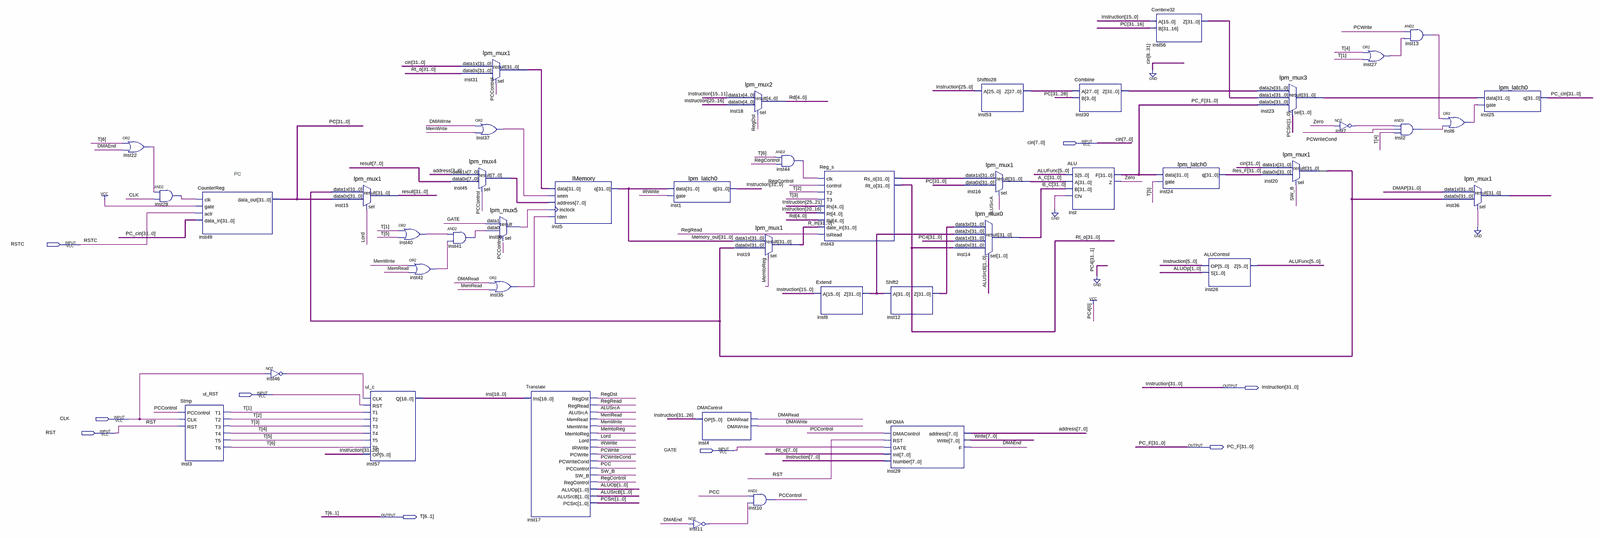
[diagram p0: schematic sheet, whole]
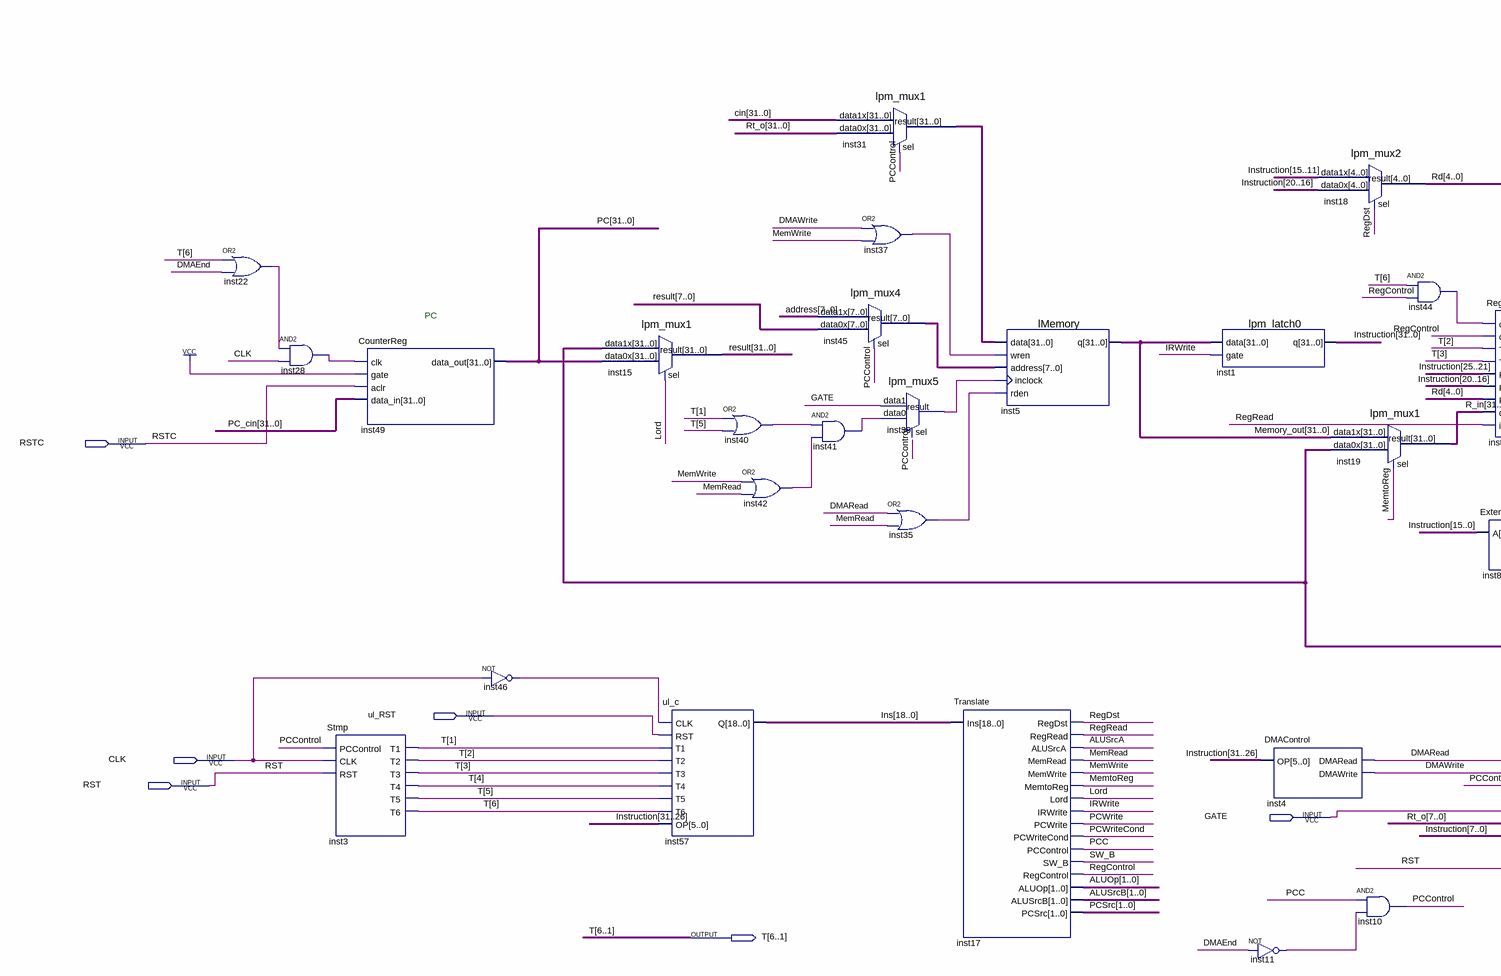
[diagram p1: schematic sheet, left part]
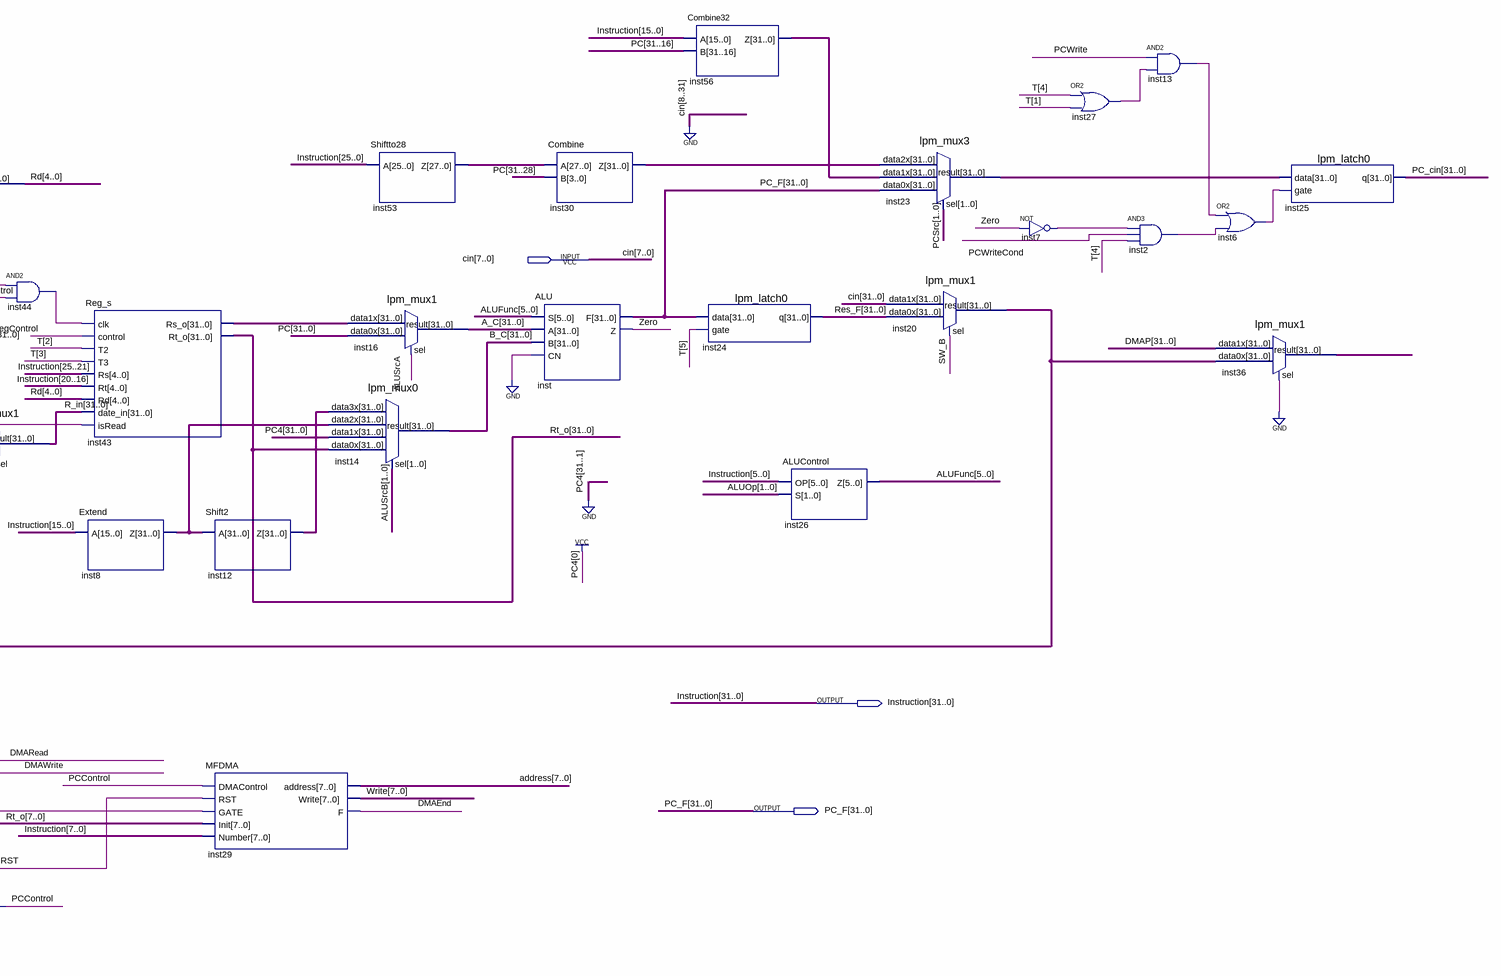
[diagram p2: schematic sheet, right part]
// Quartus schematic MIPS.bdf as structural Verilog: 45 symbols, 9 pins
module MIPS (
  input  [7:0] cin,
  input  RSTC,
  input  ul_RST,
  input  CLK,
  input  RST,
  input  GATE,
  output [31:0] Instruction,
  output [31:0] PC_F,
  output [6:1] T
);

  wire ALUSrcA, DMAEnd, DMARead, DMAWrite, inst2_out, inst6_out, inst7_out, inst11_out, inst13_out,
       inst22_out, inst27_out, inst28_out, inst35_out, inst37_out, inst39_result, inst40_out, inst41_out,
       inst42_out, inst44_out, inst46_out, IRWrite, Lord, MemRead, MemtoReg, MemWrite, PCC, PCControl,
       PCWrite, PCWriteCond, RegControl, RegDst, RegRead, SW_B, Zero;
  wire [1:0] ALUOp, ALUSrcB, PCSrc;
  wire [4:0] Rd;
  wire [5:0] ALUFunc;
  wire [7:0] address, inst45_result, Write;
  wire [18:0] Ins;
  wire [27:0] inst53_z;
  wire [31:0] A_C, B_C, DMAP, inst8_z, inst12_z, inst20_result, inst23_result, inst30_z, inst31_result,
       inst36_result, inst43_rs_o, inst56_z, Memory_out, PC, PC_cin, R_in, Res_F, result, Rt_o;

  or inst22 (inst22_out, T[6], DMAEnd);
  and inst28 (inst28_out, inst22_out, CLK);
  Stmp inst3 (
    .PCControl(PCControl), .CLK(CLK), .RST(RST), .T1(T[1]), .T2(T[2]), .T3(T[3]), .T4(T[4]), .T5(T[5]),
    .T6(T[6]));
  CounterReg inst49 (.clk(inst28_out), .gate(1'b1), .aclr(RSTC), .data_in(PC_cin), .data_out(PC));
  not inst46 (inst46_out, CLK);
  lpm_mux1 inst15 (.data1x(inst20_result), .data0x(PC), .sel(Lord), .result(result));
  ul_c inst57 (
    .CLK(inst46_out), .RST(ul_RST), .T1(T[1]), .T2(T[2]), .T3(T[3]), .T4(T[4]), .T5(T[5]), .T6(T[6]),
    .OP(Instruction[31:26]), .Q(Ins));
  or inst40 (inst40_out, T[1], T[5]);
  or inst42 (inst42_out, MemWrite, MemRead);
  lpm_mux1 inst31 (.data1x({{24{1'b0}}, cin}), .data0x(Rt_o), .sel(PCControl), .result(inst31_result));
  lpm_mux4 inst45 (.data1x(address), .data0x(result[7:0]), .sel(PCControl), .result(inst45_result));
  and inst41 (inst41_out, inst40_out, inst42_out);
  or inst37 (inst37_out, DMAWrite, MemWrite);
  lpm_mux5 inst39 (.data1(GATE), .data0(inst41_out), .result(inst39_result));  // open: sel
  or inst35 (inst35_out, DMARead, MemRead);
  Translate inst17 (
    .Ins(Ins), .RegDst(RegDst), .RegRead(RegRead), .ALUSrcA(ALUSrcA), .MemRead(MemRead), .MemWrite(MemWrite),
    .MemtoReg(MemtoReg), .Lord(Lord), .IRWrite(IRWrite), .PCWrite(PCWrite), .PCWriteCond(PCWriteCond),
    .PCControl(PCC), .SW_B(SW_B), .RegControl(RegControl), .ALUOp(ALUOp), .ALUSrcB(ALUSrcB), .PCSrc(PCSrc));
  lMemory inst5 (
    .data(inst31_result), .wren(inst37_out), .address(inst45_result), .inclock(inst39_result),
    .rden(inst35_out), .q(Memory_out));
  lpm_latch0 inst1 (.data(Memory_out), .gate(IRWrite), .q(Instruction));
  not inst11 (inst11_out, DMAEnd);
  DMAControl inst4 (.OP(Instruction[31:26]), .DMARead(DMARead), .DMAWrite(DMAWrite));
  lpm_mux2 inst18 (.data1x(Instruction[15:11]), .data0x(Instruction[20:16]), .sel(RegDst), .result(Rd));
  lpm_mux1 inst19 (.data1x(Memory_out), .data0x(inst20_result), .sel(MemtoReg), .result(R_in));
  and inst10 (PCControl, PCC, inst11_out);
  and inst44 (inst44_out, T[6], RegControl);
  Reg_s inst43 (
    .clk(inst44_out), .control(RegControl), .T2(T[2]), .T3(T[3]), .Rs(Instruction[25:21]),
    .Rt(Instruction[20:16]), .Rd(Rd), .date_in(R_in), .isRead(RegRead), .Rs_o(inst43_rs_o), .Rt_o(Rt_o));
  Extend inst8 (.A(Instruction[15:0]), .Z(inst8_z));
  Shift2 inst12 (.A(inst8_z), .Z(inst12_z));
  MFDMA inst29 (
    .DMAControl(PCControl), .RST(RST), .GATE(GATE), .Init(Rt_o[7:0]), .Number(Instruction[7:0]),
    .address(address), .Write(Write), .F(DMAEnd));
  lpm_mux1 inst16 (.data1x(inst43_rs_o), .data0x(PC), .sel(ALUSrcA), .result(A_C));
  lpm_mux0 inst14 (
    .data3x(inst12_z), .data2x(inst8_z), .data1x(32'b00000000000000000000000000000001), .data0x(Rt_o),
    .sel(ALUSrcB), .result(B_C));
  Shiftto28 inst53 (.A(Instruction[25:0]), .Z(inst53_z));
  Combine inst30 (.A(inst53_z), .B(PC[31:28]), .Z(inst30_z));
  ALU inst (.S(ALUFunc), .A(A_C), .B(B_C), .CN(1'b0), .F(PC_F), .Z(Zero));
  Combine32 inst56 (.A(Instruction[15:0]), .B(PC[31:16]), .Z(inst56_z));
  lpm_latch0 inst24 (.data(PC_F), .gate(T[5]), .q(Res_F));
  ALUControl inst26 (.OP(Instruction[5:0]), .S(ALUOp), .Z(ALUFunc));
  lpm_mux3 inst23 (.data2x(inst30_z), .data1x(inst56_z), .data0x(PC_F), .sel(PCSrc), .result(inst23_result));
  lpm_mux1 inst20 (.data1x({{24{1'b0}}, cin}), .data0x(Res_F), .sel(SW_B), .result(inst20_result));
  not inst7 (inst7_out, Zero);
  or inst27 (inst27_out, T[4], T[1]);
  and inst13 (inst13_out, PCWrite, inst27_out);
  and inst2 (inst2_out, inst7_out, PCWriteCond, T[4]);
  or inst6 (inst6_out, inst13_out, inst2_out);
  lpm_mux1 inst36 (.data1x(DMAP), .data0x(inst20_result), .sel(1'b0), .result(inst36_result));
  lpm_latch0 inst25 (.data(inst23_result), .gate(inst6_out), .q(PC_cin));

  // Notes on the sheet:
  //   PC
endmodule
